# EAGLE design picdiv (EAGLE 7.7.0)
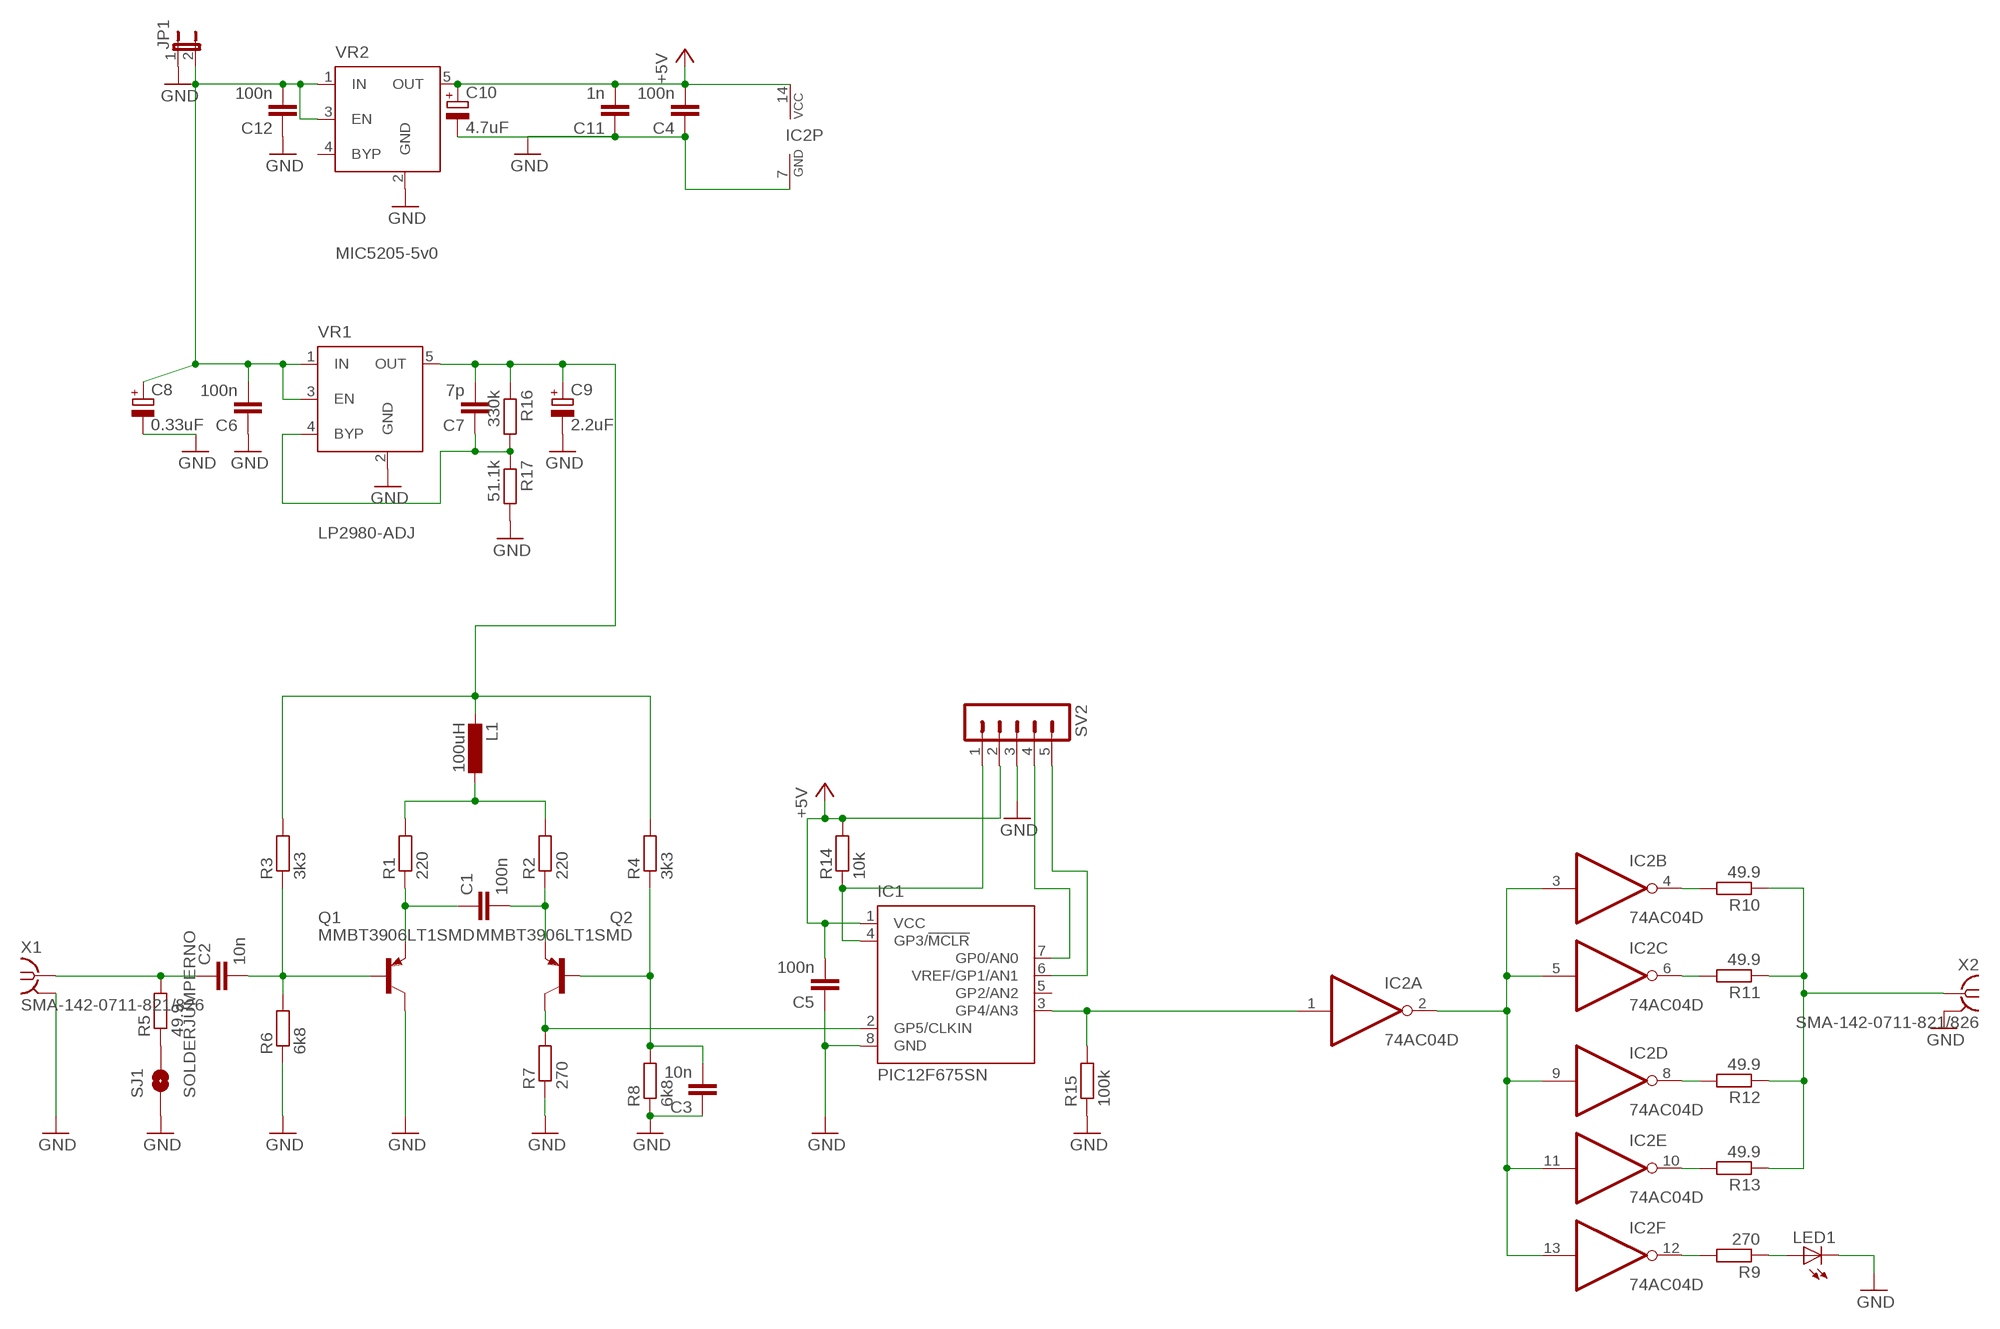
[diagram p0: schematic, sheet 1]

## Parts
C1  100n  C-EUC0603  [C0603]
C2  10n  C-EUC0603  [C0603]
C3  10n  C-EUC0603  [C0603]
C4  100n  C-EUC0603  [C0603]
C5  100n  C-EUC0603  [C0603]
C6  100n  C-EUC0603  [C0603]
C7  7p  C-EUC0603  [C0603]
C8  0.33uF  CPOL-EUSMCA  [SMC_A]
C9  2.2uF  CPOL-EUSMCA  [SMC_A]
C10  4.7uF  CPOL-EUSMCA  [SMC_A]
C11  1n  C-EUC0603  [C0603]
C12  100n  C-EUC0603  [C0603]
IC1  PIC12F675SN  [SO-08]
IC2  74AC04D  [SO14]
JP1  JUMPER-2PTH  [1X02]
L1  100uH  L-EUL2012C  [L2012C]
LED1  LEDCHIPLED_0603  [CHIPLED_0603]
Q1  MMBT3906LT1SMD  [SOT23-BEC]
Q2  MMBT3906LT1SMD  [SOT23-BEC]
R1  220  R-EU_R0603  [R0603]
R2  220  R-EU_R0603  [R0603]
R3  3k3  R-EU_R0603  [R0603]
R4  3k3  R-EU_R0603  [R0603]
R5  49.9  R-EU_R0603  [R0603]
R6  6k8  R-EU_R0603  [R0603]
R7  270  R-EU_R0603  [R0603]
R8  6k8  R-EU_R0603  [R0603]
R9  270  R-EU_R0603  [R0603]
R10  49.9  R-EU_R0603  [R0603]
R11  49.9  R-EU_R0603  [R0603]
R12  49.9  R-EU_R0603  [R0603]
R13  49.9  R-EU_R0603  [R0603]
R14  10k  R-EU_R0603  [R0603]
R15  100k  R-EU_R0603  [R0603]
R16  330k  R-EU_R0603  [R0603]
R17  51.1k  R-EU_R0603  [R0603]
SJ1  SOLDERJUMPERNO  [SJ_2S-NO]
SV2  MA05-1  [MA05-1]
VR1  LP2980-ADJ  MIC5219XX  [SOT23-5]
VR2  MIC5205-5v0  MIC5219XX  [SOT23-5]
X1  SMA-142-0711-821/826  [J502-ND-142-0711-821/826]
X2  SMA-142-0711-821/826  [J502-ND-142-0711-821/826]

## Nets
+5V: C4.2 C5.2 C10.+ C11.2 IC1.1(VCC) IC2.14(P:VCC) R14.2 SV2.2 VR2.5(OUT)
+8V: C7.2 C9.+ L1.2 R3.2 R4.2 R16.1 VR1.5(OUT)
GND: C3.1 C4.1 C5.1 C6.1 C8.- C9.- C10.- C11.1 C12.1 IC1.8(GND) IC2.7(P:GND) JP1.1 LED1.C Q1.C R6.1 R7.1 R8.1 R15.1 R17.2 SJ1.1 SV2.3 VR1.2(GND) VR2.2(GND) X1.G@1(GND) X2.G@1(GND)
N$1: C3.2 Q2.B R4.1 R8.2
N$2: R5.1 SJ1.2
N$3: C2.1 R5.2 X1.1
N$4: C2.2 Q1.B R3.1 R6.2
N$5: L1.1 R1.2 R2.2
N$6: C1.2 Q2.E R2.1
N$7: C1.1 Q1.E R1.1
N$9: IC1.2(GP5/CLKIN) Q2.C R7.2
N$10: IC2.12(F:O) R9.2
N$12: LED1.A R9.1
N$13: IC2.2(A:O) IC2.3(B:I) IC2.5(C:I) IC2.9(D:I) IC2.11(E:I) IC2.13(F:I)
N$14: IC2.10(E:O) R13.2
N$15: IC2.4(B:O) R10.2
N$16: IC2.6(C:O) R11.2
N$17: IC2.8(D:O) R12.2
N$19: IC1.4(GP3/!MCLR) R14.1 SV2.1
N$22: C6.2 C8.+ C12.2 JP1.2 VR1.1(IN) VR1.3(EN) VR2.1(IN) VR2.3(EN)
N$23: IC1.7(GP0/AN0) SV2.4
N$24: IC1.6(VREF/GP1/AN1) SV2.5
OUT: R10.1 R11.1 R12.1 R13.1 X2.1
PICOUT: IC1.3(GP4/AN3) IC2.1(A:I) R15.2
VADJ: C7.1 R16.2 R17.1 VR1.4(BYP)
Unconnected: IC1.5(GP2/AN2) VR2.4(BYP)

## Power pins joined to a net without a drawn wire
GND: X1.G@2(GND) X1.G@3(GND) X1.G@4(GND) X2.G@2(GND) X2.G@3(GND) X2.G@4(GND)

## Library data of the parts
C1-C7 C11 C12 = rcl:C-EU: CAPACITOR, European symbol
C8-C10 = rcl:CPOL-EU: POLARIZED CAPACITOR, European symbol
IC1 = microchip:PIC12F675: 8-Pin FLASH-Based 8-Bit CMOS Microcontroller Precision Internal 4 MHz oscillator factory calibrated to ±1% Low Power Features: Standby Current: - 1 nA @ 2.0V, typical Operating Current: - 8.5µA @ 32 kHz, 2.0V, typical - 100µA @ 1 MHz, 2.0V, typical Watchdog Timer Current: - 300 nA @ 2.0V, typical Timer1 oscillator current: - 4µA @ 32 kHz, 2.0V, typical Analog-to-Digital Converter module: - 10-bit resolution - Programmable 4-channel input - Voltage reference input Source: http://www.microchip.com .. 41190E.pdf; MF: MICROCHIP; MPN: PIC12F675-E/SN; OC_FARNELL: 9759026; OC_NEWARK: 92C4341
IC2 = 74xx-eu:74*04: Hex INVERTER
JP1 = SparkFun:JUMPER-2: Jumper Basic 0.1" spaced jumper. Use with breakaway headers.
L1 = rcl:L-EU: INDUCTOR, European symbol
LED1 = led:LED: LED OSRAM: - CHIPLED LG R971, LG N971, LY N971, LG Q971, LY Q971, LO R971, LY R971 LH N974, LH R974 LS Q976, LO Q976, LY Q976 LO Q996 - Hyper CHIPLED LW Q18S LB Q993, LB Q99A, LB R99A - SideLED LS A670, LO A670, LY A670, LG A670, LP A670 LB A673, LV A673, LT A673, LW A673 LH A674 LY A675 LS A676, LA A676, LO A676, LY A676, LW A676 LS A679, LY A679, LG A679 - Hyper Micro SIDELED® LS Y876, LA Y876, LO Y876, LY Y876 LT Y87S - SmartLED LW L88C, LW L88S LB L89C, LB L89S, LG L890 LS L89K, LO L89K, LY L89K LS L896, LA L896, LO L896, LY L896 - TOPLED LS T670, LO T670, LY T670, LG T670, LP T670 LSG T670, LSP T670, LSY T670, LOP T670, LYG T670 LG T671, LOG T671, LSG T671 LB T673, LV T673, LT T673, LW T673 LH T674 LS T676, LA T676, LO T676, LY T676, LB T676, LH T676, LSB T676, LW T676 LB T67C, LV T67C, LT T67C, LS T67K, LO T67K, LY T67K, LW E67C LS E67B, LA E67B, LO E67B, LY E67B, LB E67C, LV E67C, LT E67C LW T67C LS T679, LY T679, LG T679 LS T770, LO T770, LY T770, LG T770, LP T770 LB T773, LV T773, LT T773, LW T773 LH T774 LS E675, LA E675, LY E675, LS T675 LS T776, LA T776, LO T776, LY T776, LB T776 LHGB T686 LT T68C, LB T68C - Hyper Mini TOPLED® LB M676 - Mini TOPLED Santana® LG M470 LS M47K, LO M47K, LY M47K Source: http://www.osram.convergy.de LUXEON: - LUMILED® LXK2-PW12-R00, LXK2-PW12-S00, LXK2-PW14-U00, LXK2-PW14-V00 LXK2-PM12-R00, LXK2-PM12-S00, LXK2-PM14-U00 LXK2-PE12-Q00, LXK2-PE12-R00, LXK2-PE12-S00, LXK2-PE14-T00, LXK2-PE14-U00 LXK2-PB12-K00, LXK2-PB12-L00, LXK2-PB12-M00, LXK2-PB14-N00, LXK2-PB14-P00, LXK2-PB14-Q00 LXK2-PR12-L00, LXK2-PR12-M00, LXK2-PR14-Q00, LXK2-PR14-R00 LXK2-PD12-Q00, LXK2-PD12-R00, LXK2-PD12-S00 LXK2-PH12-R00, LXK2-PH12-S00 LXK2-PL12-P00, LXK2-PL12-Q00, LXK2-PL12-R00 Source: www.luxeon.com KINGBRIGHT: KA-3528ASYC Source: www.kingbright.com
Q1 Q2 = transistor-pnp:MMBT3906*: PNP Transistror
R1-R17 = rcl:R-EU_: RESISTOR, European symbol
SJ1 = SparkFun:SOLDERJUMPER: Solder Jumper Standard SMD solder jumper. Used to automate production. Two varients : Normally Open and Normally Closed are the same, but have different paste layers. NC will have a large amount of paste and should jumper during reflow.
SV2 = con-lstb:MA05-1: PIN HEADER; OC_FARNELL: unknown; OC_NEWARK: unknown
VR1 VR2 = v-reg-micrel:MIC5219XX: VOLTAGE REGULATOR
X1 X2 = con-coax:SMA-: SMA 50 Ohm End Launch Jack Receptacle - Round Contact Johnson Components Source: www.johnsoncomponents.com .. J502-ND.pdf; MF: JOHNSON COMPONENTS; MPN: 142-0711-821; OC_FARNELL: 1019328; OC_NEWARK: 16F3627

## Board
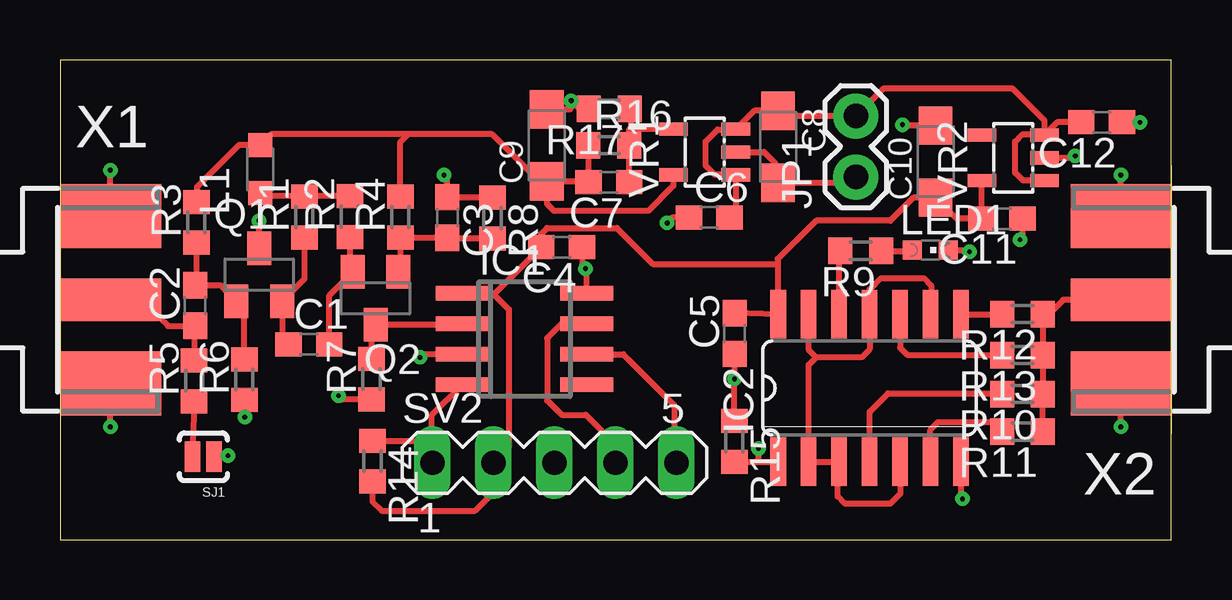
[diagram p1: board, top side]
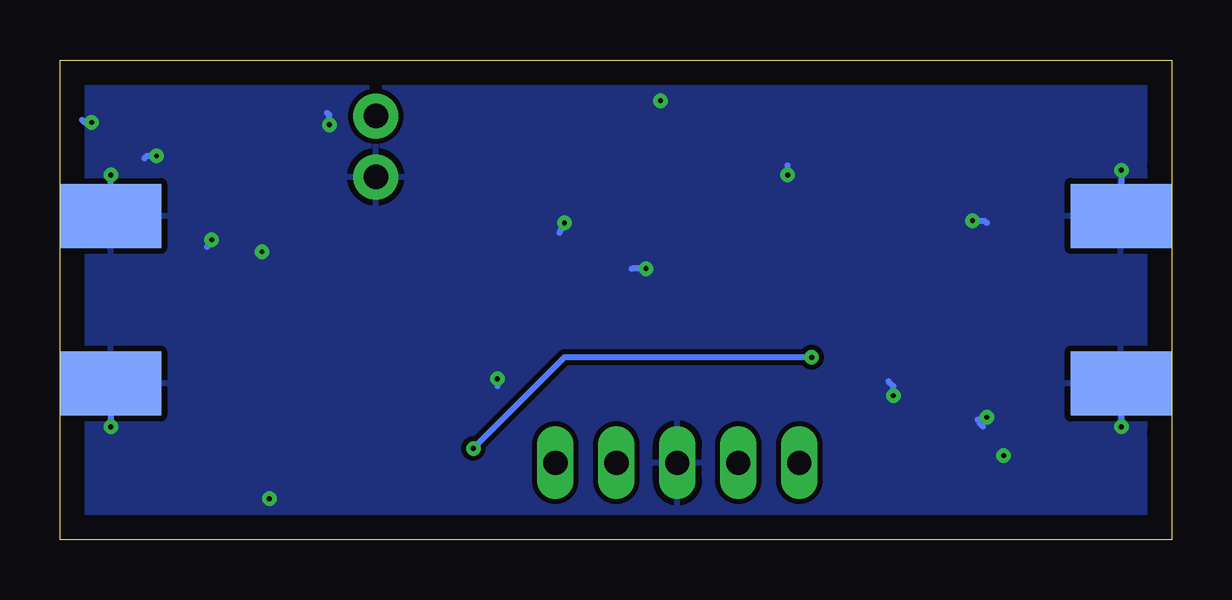
[diagram p2: board, bottom side, seen from below]

Size 46.32 x 20 mm. Coordinates in mm from the lower left corner, seen from the top.
Outline: 0,0 46.3,0 46.3,20 0,20 0,0
Copper layers (1*16): Top 0.035mm / dielectric 1.5mm / Bottom 0.035mm
Design rules "default": minimum track width 10mil, minimum drill 24mil, track to track 8mil, track to pad 8mil, pad to pad 8mil, via to via 8mil, smd to smd 8mil, copper to edge 40mil, drill to drill 8mil, minimum pad ring 10mil, minimum via ring 8mil, stop-mask expansion 4mil, vias tented up to drill 0mil, thermal gap 10mil

### Footprints (pad centres in the part's own frame; a part is rotated, then mirrored left to right if it is on the bottom)
C0603 = smd 1.1 x 1: 1 -0.85,0; 2 0.85,0
SMC_A = smd 1.6 x 1.4: + -1.5,0; - 1.5,0
SO-08 = smd 0.6 x 2.2: 1 -1.905,-2.6; 2 -0.635,-2.6; 3 0.635,-2.6; 4 1.905,-2.6; 5 1.905,2.6; 6 0.635,2.6; 7 -0.635,2.6; 8 -1.905,2.6
SO14 = smd 0.66 x 2.032: 1 -3.81,-3.073; 2 -2.54,-3.073; 3 -1.27,-3.073; 4 0,-3.073; 5 1.27,-3.073; 6 2.54,-3.073; 7 3.81,-3.073; 8 3.81,3.073; 9 2.54,3.073; 10 1.27,3.073; 11 0,3.073; 12 -1.27,3.073; 13 -2.54,3.073; 14 -3.81,3.073
1X02 = drill 1.016 pad 1.88: 1 0,0; 2 2.54,0
L2012C = smd 1 x 1: 1 -1,0; 2 1,0
CHIPLED_0603 = smd 0.8 x 0.8: A 0,-0.75; C 0,0.75
SOT23-BEC = smd 1 x 1.4: B -0.95,-1.1; C 0,1.1; E 0.95,-1.1
R0603 = smd 1 x 1.1: 1 -0.85,0; 2 0.85,0
SJ_2S-NO = smd 0.635 x 1.27: 1 -0.45,0; 2 0.45,0
MA05-1 = drill 1.016 long: 1 -5.08,0; 2 -2.54,0; 3 0,0; 4 2.54,0; 5 5.08,0
SOT23-5 = smd 0.55 x 1.2: 1 -0.95,-1.3; 2 0,-1.3; 3 0.95,-1.3; 4 0.95,1.3; 5 -0.95,1.3
J502-ND-142-0711-821/826 = smd 4.191 x 1.778: 1 2.115,0 | smd 4.191 x 2.667: G@1 2.115,3.495; G@2 2.115,-3.495 | smd 4.191 x 2.667 bottom: G@3 2.115,3.495; G@4 2.115,-3.495

### Placement (x,y rotation side)
C1  10.37,8.14 0 top
C2  5.64,9.76 90 top
C3  16.14,13.43 270 top
C4  20.9,12.2 180 top
C5  28.11,8.59 90 top
C6  27.05,13.43 0 top
C7  22.87,14.91 180 top
C8  29.92,16.38 270 top
C9  20.28,16.44 90 top
C10  36.48,15.76 90 top
C11  39.25,13.39 180 top
C12  43.4,17.4 180 top
IC1  19.35,8.36 270 top
IC2  33.73,6.32 0 top
JP1  33.16,15.12 90 top
L1  8.34,15.44 90 top
LED1  36.26,12.07 270 top
Q1  8.3,11.04 0 top
Q2  13.15,10.06 180 top
R1  10.18,13.45 90 top
R2  12.08,13.47 90 top
R3  5.68,13.23 90 top
R4  14.18,13.45 90 top
R5  5.59,6.62 90 top
R6  7.68,6.67 90 top
R7  12.98,6.69 90 top
R8  18.02,13.41 270 top
R9  33.36,12.04 180 top
R10  40.1,6.07 180 top
R11  40.1,4.5 180 top
R12  40.1,9.4 180 top
R13  40.1,7.69 180 top
R14  13.02,3.27 270 top
R15  28.1,4.09 270 top
R16  22.87,16.44 0 top
R17  22.88,17.96 180 top
SJ1  5.97,3.45 180 top
SV2  20.6,3.2 0 top
VR1  26.86,16.16 90 top
VR2  39.72,15.92 90 top
X1  0,10 0 top
X2  46.32,10 180 top

### Tracks (layer width: path | path; a pad name or v marks a point on that pad's centre or on a via)
+5V
  Top 0.254: C5.2 IC2.14 29.9,9.41 29.9,11.5 | IC1.1 18.04,10.27 | 18.04,10.27 18.7,9.6 18.7,3.87 18.06,3.23 SV2.2 18.1,3.16 18.1,2 17.3,1.2 13.4,1.2 13.02,1.58 R14.2 | 18.04,10.27 18.11,10.27 C4.2 20.05,12.75 20.3,13 23.2,13 24.7,11.5 29.9,11.5 | VR2.5 38.4,14.95 C11.2 37.35,13.39 C10.+ 35.56,14.26 34.6,13.3 31.5,13.3 29.9,11.7 29.9,11.5
+8V
  Top 0.254: R16.1 C7.2 21.99,14.94 C9.+ | 25.6,15.17 VR1.5 25.56,14.76 24.5,13.7 20.6,13.7 20.3,14 20.3,14.92 C9.+ | C9.+ 19.96,14.94 18,16.9 14.5,16.9 | 14.5,16.9 8.8,16.9 L1.2 7.44,16.44 5.7,14.7 5.7,14.1 R3.2 | R4.2 14.18,16.58 14.5,16.9
GND  (via drill 0.2)
  Top 0.254: 28.08,6.72 v28.1,6.7 | R15.1 v28.1,6.7 | C5.1 v28.1,6.7 | LED1.C 37.83,12.07 v37.9,12 | SJ1.1 6.98,3.48 v7,3.5 | Q1.C v8.3,13.3 | R7.1 11.76,5.84 v11.6,6 | R8.1 18,14.28 C3.1 16.14,15.06 v16,15.2 | IC2.7 37.54,1.76 v37.6,1.7 | VR2.2 42.22,15.92 v42.3,16 | 21.75,10.46 IC1.8 21.95,11.25 v21.9,11.3 21.75,11.45 C4.1 | C11.1 40.1,12.6 v40,12.5 | VR1.2 29.34,16.16 29.8,15.7 29.8,15 C8.- 32.92,14.88 JP1.1 | C9.- 21.24,17.94 21.3,18 v21.3,18.3 21.64,17.96 R17.2 | C10.- 35.14,17.26 v35.1,17.3 | C12.1 v45,17.4 | C6.1 25.53,13.43 v25.3,13.2 | v2.1,4.7 X1.G@4 | X1.G@1 v2.1,15.4 | v44.2,4.7 X2.G@1 | X2.G@4 v44.2,15.2 | R6.1 7.68,5.42 v7.7,5.1
  Bottom 0.254: v28.1,6.7 28.1,6.4 | v37.9,12 38.1,12 | 8.1,5 v7.7,5.1 8,4.85 7.85,4.71 | v8.3,13.3 7.8,13.3 7.7,13.2 | v11.6,6 11.6,6.4 11.8,6.6 | v16,15.2 16,15.6 | v42.3,16 42.7,16 42.8,15.9 | v21.9,11.3 22.5,11.3 | v40,12.5 40,12.4 40.2,12.2 | v21.3,18.3 21.3,18.5 | v35.1,17.3 35.1,17.7 35.2,17.8 | v45,17.4 45.3,17.4 45.4,17.5 | v25.3,13.2 25.5,12.8 | X1.G@4 v2.1,4.7 | v2.1,15.4 X1.G@1 | X2.G@1 v44.2,4.7 | v44.2,15.2 44.3,13.6 X2.G@4
  pour Bottom: -3.7,0.1 46.3,0.1 46.3,19 -3.8,19 -3.8,0.6
N$1
  Top 0.254: Q2.B 14.18,11.24 R4.1 14.2,12.58 C3.2 16.16,12.56 R8.2
N$2
  Top 0.254: R5.1 SJ1.2
N$3
  Top 0.254: R5.2 C2.1 4.5,8.9 4.14,9.26 X1.1
N$4
  Top 0.254: R3.1 5.68,10.65 C2.2 6.68,10.61 Q1.B 7.68,9.61 R6.2
N$5
  Top 0.254: R2.2 10.2,14.32 | 10.2,14.32 R1.2 | 10.2,14.32 8.46,14.32 L1.1
N$6
  Top 0.254: R2.1 12.08,11.28 Q2.E 11.22,10.18 C1.2
N$7
  Top 0.254: C1.1 9.25,8.41 Q1.E 10.18,10.87 R1.1
N$9
  Top 0.254: R7.2 12.98,8.79 Q2.C 16.71,8.96 IC1.2
N$10
  Top 0.254: IC2.12 32.46,11.99 R9.2
N$12
  Top 0.254: R9.1 35.48,12.04 LED1.A
N$13
  Top 0.254: 31.5,7.6 33.4,7.6 33.73,7.93 IC2.11 33.73,10.43 34.2,10.9 36,10.9 36.3,10.6 36.3,9.42 IC2.9 | 31.5,7.6 31.2,7.9 IC2.13 | IC2.5 35,1.9 34.6,1.5 32.7,1.5 32.4,1.8 32.4,3.19 IC2.3 IC2.2 31.19,7.29 31.5,7.6
N$14
  Top 0.254: IC2.10 35,8 35.3,7.7 R13.2
N$15
  Top 0.254: IC2.4 33.73,5.33 34.5,6.1 39.22,6.1 R10.2
N$16
  Top 0.254: IC2.6 36.27,4.57 36.6,4.9 38.85,4.9 R11.2
N$17
  Top 0.254: IC2.8 R12.2
N$19
  Top 0.254: 15.49,4 15.49,5.2 IC1.4 | R14.1 15.37,4.12 15.49,4 | SV2.1 15.52,3.97 15.49,4
N$22
  Top 0.254: VR2.1 40.13,14.97 39.8,15.3 39.8,16.6 40.1,16.9 40.99,16.9 VR2.3 | VR2.3 41,16.89 41,17.5 39.7,18.8 34.3,18.8 JP1.2 30.14,17.66 C8.+ 28.93,17.88 VR1.3 27.4,17.1 26.9,16.6 26.9,15.6 27.29,15.21 VR1.1 28.16,13.69 C6.2 | C12.2 41.55,17.4 VR2.3
N$23
  Top 0.254: IC1.7 20.89,8.99 20.3,8.4 20.3,5.8 20.9,5.2 21.9,5.2 23.2,3.9 23.2,3.29 23.14,3.23 SV2.4
N$24
  Top 0.254: IC1.6 23.48,7.72 25.6,5.6 25.6,3.25 25.65,3.2 SV2.5
OUT
  Top 0.254: R10.1 R13.1 R12.1 41.11,9.56 41.36,9.56 41.8,10 X2.1 | R11.1 R10.1 | 41.27,6.39 R10.1
PICOUT  (via drill 0.2)
  Top 0.254: R15.2 29,3.24 | 29,3.24 IC2.1 | IC1.3 15.12,7.72 v15,7.6 | v29.1,3.8 29.1,3.34 29,3.24
  Bottom 0.254: v15,7.6 25.3,7.6 v29.1,3.8
VADJ
  Top 0.254: VR1.4 23.89,17.11 23.8,17.2 | 23.8,17.2 23.8,17.89 R17.1 | 23.8,17.2 23.72,17.12 R16.2 C7.1